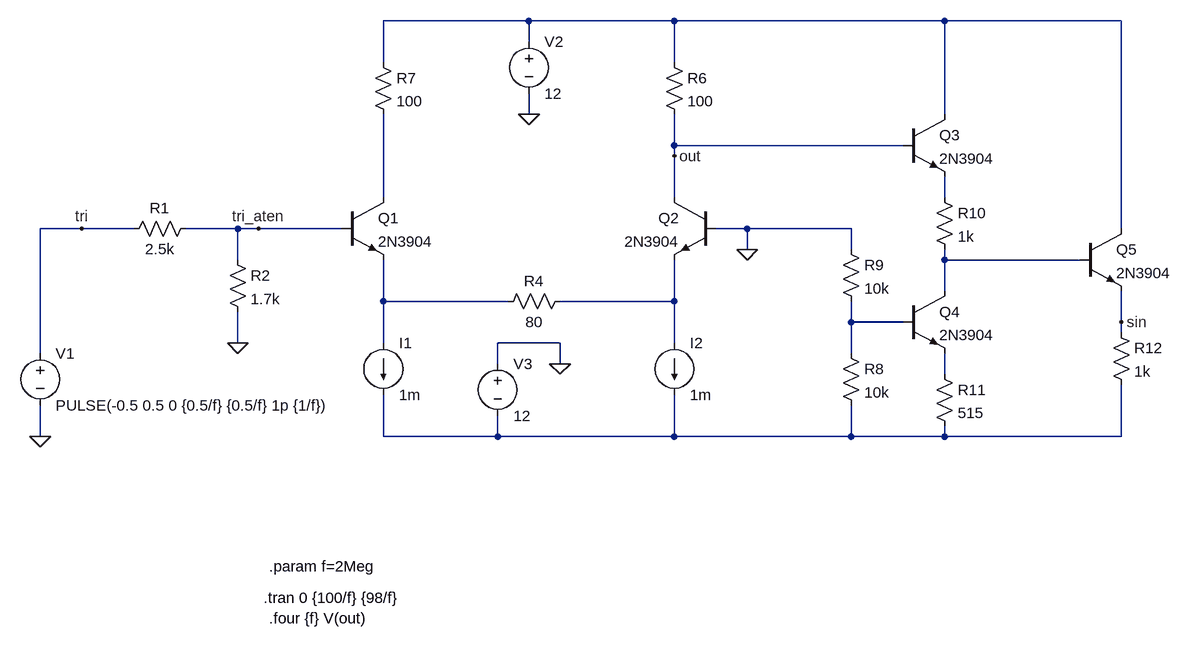
[diagram p0: schematic sine-shaper.asc]
sine-shaper.asc, the LTspice schematic file:
Version 4
SHEET 1 1592 872
WIRE 592 -64 368 -64
WIRE 816 -64 592 -64
WIRE 1232 -64 816 -64
WIRE 1504 -64 1232 -64
WIRE 592 -32 592 -64
WIRE 368 0 368 -64
WIRE 816 0 816 -64
WIRE 592 80 592 48
WIRE 1232 80 1232 -64
WIRE 816 128 816 80
WIRE 1168 128 816 128
WIRE 816 144 816 128
WIRE 368 208 368 80
WIRE 816 208 816 144
WIRE 1232 208 1232 176
WIRE -96 256 -160 256
WIRE -16 256 -96 256
WIRE 144 256 64 256
WIRE 176 256 144 256
WIRE 304 256 176 256
WIRE 928 256 880 256
WIRE 1088 256 928 256
WIRE 1504 256 1504 -64
WIRE 928 288 928 256
WIRE 1088 288 1088 256
WIRE 144 304 144 256
WIRE 1232 304 1232 288
WIRE 1440 304 1232 304
WIRE 1232 352 1232 304
WIRE 368 368 368 304
WIRE 560 368 368 368
WIRE 816 368 816 304
WIRE 816 368 640 368
WIRE 1088 400 1088 368
WIRE 1168 400 1088 400
WIRE 1504 400 1504 352
WIRE 1504 416 1504 400
WIRE 144 432 144 384
WIRE 368 432 368 368
WIRE 640 432 544 432
WIRE 816 432 816 368
WIRE -160 448 -160 256
WIRE 1088 448 1088 400
WIRE 544 464 544 432
WIRE 640 464 640 432
WIRE 1232 480 1232 448
WIRE -160 576 -160 528
WIRE 368 576 368 512
WIRE 544 576 544 544
WIRE 544 576 368 576
WIRE 816 576 816 512
WIRE 816 576 544 576
WIRE 1088 576 1088 528
WIRE 1088 576 816 576
WIRE 1232 576 1232 560
WIRE 1232 576 1088 576
WIRE 1504 576 1504 496
WIRE 1504 576 1232 576
FLAG -160 576 0
FLAG 144 432 0
FLAG 928 288 0
FLAG 592 80 0
FLAG 640 464 0
FLAG 1504 400 sin
FLAG -96 256 tri
FLAG 176 256 tri_aten
FLAG 816 144 out
SYMBOL voltage -160 432 R0
WINDOW 123 0 0 Left 0
WINDOW 39 0 0 Left 0
SYMATTR InstName V1
SYMATTR Value PULSE(-0.5 0.5 0 {0.5/f} {0.5/f} 1p {1/f})
SYMBOL res 80 240 R90
WINDOW 0 0 56 VBottom 2
WINDOW 3 32 56 VTop 2
SYMATTR InstName R1
SYMATTR Value 2.5k
SYMBOL res 128 288 R0
SYMATTR InstName R2
SYMATTR Value 1.7k
SYMBOL res 656 352 R90
WINDOW 0 0 56 VBottom 2
WINDOW 3 32 56 VTop 2
SYMATTR InstName R4
SYMATTR Value 80
SYMBOL res 800 -16 R0
SYMATTR InstName R6
SYMATTR Value 100
SYMBOL res 352 -16 R0
SYMATTR InstName R7
SYMATTR Value 100
SYMBOL npn 304 208 R0
SYMATTR InstName Q1
SYMATTR Value 2N3904
SYMBOL npn 880 208 M0
SYMATTR InstName Q2
SYMATTR Value 2N3904
SYMBOL npn 1168 80 R0
SYMATTR InstName Q3
SYMATTR Value 2N3904
SYMBOL npn 1168 352 R0
SYMATTR InstName Q4
SYMATTR Value 2N3904
SYMBOL res 1072 432 R0
SYMATTR InstName R8
SYMATTR Value 10k
SYMBOL res 1072 272 R0
SYMATTR InstName R9
SYMATTR Value 10k
SYMBOL res 1216 192 R0
SYMATTR InstName R10
SYMATTR Value 1k
SYMBOL res 1216 464 R0
SYMATTR InstName R11
SYMATTR Value 515
SYMBOL npn 1440 256 R0
SYMATTR InstName Q5
SYMATTR Value 2N3904
SYMBOL res 1488 400 R0
SYMATTR InstName R12
SYMATTR Value 1k
SYMBOL voltage 592 -48 R0
WINDOW 123 0 0 Left 0
WINDOW 39 0 0 Left 0
SYMATTR InstName V2
SYMATTR Value 12
SYMBOL voltage 544 448 R0
WINDOW 123 0 0 Left 0
WINDOW 39 0 0 Left 0
SYMATTR InstName V3
SYMATTR Value 12
SYMBOL current 368 432 R0
WINDOW 123 0 0 Left 0
WINDOW 39 0 0 Left 0
SYMATTR InstName I1
SYMATTR Value 1m
SYMBOL current 816 432 R0
WINDOW 123 0 0 Left 0
WINDOW 39 0 0 Left 0
SYMATTR InstName I2
SYMATTR Value 1m
TEXT 192 776 Left 2 !.param f=2Meg
TEXT 184 824 Left 2 !.tran 0 {100/f} {98/f}
TEXT 192 856 Left 2 !.four {f} V(out)

The netlist it stands for:
* sine-shaper.asc
V1 tri 0 PULSE(-0.5 0.5 0 {0.5/f} {0.5/f} 1p {1/f})
R1 tri_aten tri 2.5k
R2 tri_aten 0 1.7k
R4 N006 N005 80
R6 N001 out 100
R7 N001 N002 100
Q1 N002 tri_aten N005 0 2N3904
Q2 out 0 N006 0 2N3904
Q3 N001 out N003 0 2N3904
Q4 N004 N007 N008 0 2N3904
R8 N007 N009 10k
R9 0 N007 10k
R10 N003 N004 1k
R11 N008 N009 515
Q5 N001 N004 sin 0 2N3904
R12 sin N009 1k
V2 N001 0 12
V3 0 N009 12
I1 N005 N009 1m
I2 N006 N009 1m
.model NPN NPN
.model PNP PNP
.lib standard.bjt
.param f=2Meg
.tran 0 {100/f} {98/f}
.four {f} V(out)
.backanno
.end